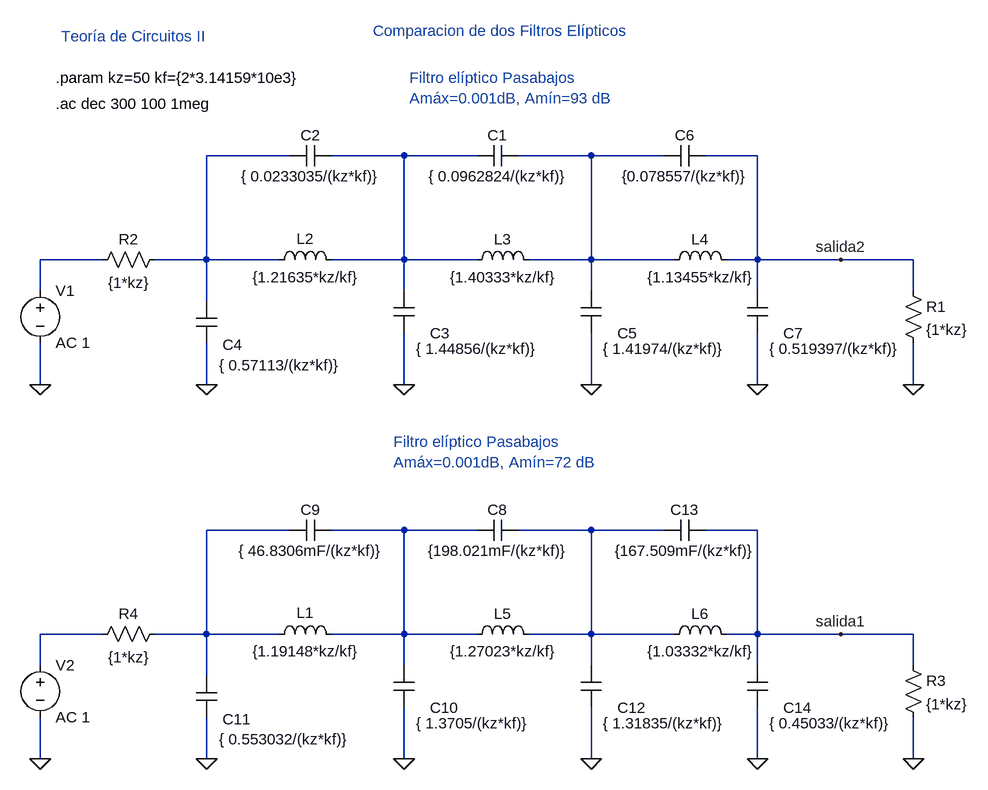
[diagram p0: schematic Filtro elíptico.asc]
Filtro elíptico.asc, the LTspice schematic file:
Version 4
SHEET 1 1436 680
WIRE -320 -1264 -448 -1264
WIRE -144 -1264 -256 -1264
WIRE -32 -1264 -144 -1264
WIRE 144 -1264 32 -1264
WIRE 256 -1264 144 -1264
WIRE 400 -1264 320 -1264
WIRE -608 -1104 -704 -1104
WIRE -448 -1104 -448 -1264
WIRE -448 -1104 -528 -1104
WIRE -336 -1104 -448 -1104
WIRE -144 -1104 -144 -1264
WIRE -144 -1104 -256 -1104
WIRE -32 -1104 -144 -1104
WIRE 144 -1104 144 -1264
WIRE 144 -1104 48 -1104
WIRE 272 -1104 144 -1104
WIRE 400 -1104 400 -1264
WIRE 400 -1104 352 -1104
WIRE 528 -1104 400 -1104
WIRE 640 -1104 528 -1104
WIRE -704 -1056 -704 -1104
WIRE -144 -1056 -144 -1104
WIRE 144 -1056 144 -1104
WIRE 400 -1056 400 -1104
WIRE 640 -1056 640 -1104
WIRE -448 -1040 -448 -1104
WIRE -704 -912 -704 -976
WIRE -448 -912 -448 -976
WIRE -144 -912 -144 -992
WIRE 144 -912 144 -992
WIRE 400 -912 400 -992
WIRE 640 -912 640 -976
WIRE -320 -688 -448 -688
WIRE -144 -688 -256 -688
WIRE -32 -688 -144 -688
WIRE 144 -688 32 -688
WIRE 256 -688 144 -688
WIRE 400 -688 320 -688
WIRE -608 -528 -704 -528
WIRE -448 -528 -448 -688
WIRE -448 -528 -528 -528
WIRE -336 -528 -448 -528
WIRE -144 -528 -144 -688
WIRE -144 -528 -256 -528
WIRE -32 -528 -144 -528
WIRE 144 -528 144 -688
WIRE 144 -528 48 -528
WIRE 272 -528 144 -528
WIRE 400 -528 400 -688
WIRE 400 -528 352 -528
WIRE 528 -528 400 -528
WIRE 640 -528 528 -528
WIRE -704 -480 -704 -528
WIRE -144 -480 -144 -528
WIRE 144 -480 144 -528
WIRE 400 -480 400 -528
WIRE 640 -480 640 -528
WIRE -448 -464 -448 -528
WIRE -704 -336 -704 -400
WIRE -448 -336 -448 -400
WIRE -144 -336 -144 -416
WIRE 144 -336 144 -416
WIRE 400 -336 400 -416
WIRE 640 -336 640 -400
FLAG 640 -912 0
FLAG 528 -1104 salida2
FLAG 144 -912 0
FLAG -448 -912 0
FLAG -144 -912 0
FLAG 400 -912 0
FLAG -704 -912 0
FLAG 640 -336 0
FLAG 528 -528 salida1
FLAG 144 -336 0
FLAG -448 -336 0
FLAG -144 -336 0
FLAG 400 -336 0
FLAG -704 -336 0
SYMBOL res 624 -1072 R0
SYMATTR InstName R1
SYMATTR Value {1*kz}
SYMBOL res -512 -1120 R90
WINDOW 0 0 56 VBottom 0
WINDOW 3 36 56 VTop 0
SYMATTR InstName R2
SYMATTR Value {1*kz}
SYMBOL cap -32 -1248 R270
WINDOW 3 0 32 VBottom 0
WINDOW 0 32 32 VTop 0
SYMATTR Value { 0.0962824/(kz*kf)}
SYMATTR InstName C1
SYMBOL ind -352 -1088 R270
WINDOW 0 33 56 VTop 0
WINDOW 3 5 56 VBottom 0
SYMATTR InstName L2
SYMATTR Value {1.21635*kz/kf}
SYMBOL cap -320 -1248 R270
WINDOW 3 0 32 VBottom 0
WINDOW 0 32 32 VTop 0
SYMATTR Value { 0.0233035/(kz*kf)}
SYMATTR InstName C2
SYMBOL ind -48 -1088 R270
WINDOW 0 32 56 VTop 0
WINDOW 3 5 56 VBottom 0
SYMATTR InstName L3
SYMATTR Value {1.40333*kz/kf}
SYMBOL cap -160 -1056 R0
WINDOW 3 34 89 Left 0
WINDOW 0 56 65 Left 0
SYMATTR Value { 1.44856/(kz*kf)}
SYMATTR InstName C3
SYMBOL ind 256 -1088 R270
WINDOW 0 32 56 VTop 0
WINDOW 3 5 56 VBottom 0
SYMATTR InstName L4
SYMATTR Value {1.13455*kz/kf}
SYMBOL cap -464 -1040 R0
WINDOW 3 35 98 Left 0
WINDOW 0 41 67 Left 0
SYMATTR Value { 0.57113/(kz*kf)}
SYMATTR InstName C4
SYMBOL cap 128 -1056 R0
WINDOW 3 34 89 Left 0
WINDOW 0 56 65 Left 0
SYMATTR Value { 1.41974/(kz*kf)}
SYMATTR InstName C5
SYMBOL cap 256 -1248 R270
WINDOW 3 0 32 VBottom 0
WINDOW 0 32 32 VTop 0
SYMATTR Value {0.078557/(kz*kf)}
SYMATTR InstName C6
SYMBOL cap 384 -1056 R0
WINDOW 3 34 89 Left 0
WINDOW 0 56 65 Left 0
SYMATTR Value { 0.519397/(kz*kf)}
SYMATTR InstName C7
SYMBOL voltage -704 -1072 R0
SYMATTR InstName V1
SYMATTR Value AC 1
SYMBOL res 624 -496 R0
SYMATTR InstName R3
SYMATTR Value {1*kz}
SYMBOL res -512 -544 R90
WINDOW 0 0 56 VBottom 0
WINDOW 3 36 56 VTop 0
SYMATTR InstName R4
SYMATTR Value {1*kz}
SYMBOL cap -32 -672 R270
WINDOW 3 0 32 VBottom 0
WINDOW 0 32 32 VTop 0
SYMATTR Value {198.021mF/(kz*kf)}
SYMATTR InstName C8
SYMBOL ind -352 -512 R270
WINDOW 0 33 56 VTop 0
WINDOW 3 5 56 VBottom 0
SYMATTR InstName L1
SYMATTR Value {1.19148*kz/kf}
SYMBOL cap -320 -672 R270
WINDOW 3 0 32 VBottom 0
WINDOW 0 32 32 VTop 0
SYMATTR Value { 46.8306mF/(kz*kf)}
SYMATTR InstName C9
SYMBOL ind -48 -512 R270
WINDOW 0 32 56 VTop 0
WINDOW 3 5 56 VBottom 0
SYMATTR InstName L5
SYMATTR Value {1.27023*kz/kf}
SYMBOL cap -160 -480 R0
WINDOW 3 34 89 Left 0
WINDOW 0 56 65 Left 0
SYMATTR Value { 1.3705/(kz*kf)}
SYMATTR InstName C10
SYMBOL ind 256 -512 R270
WINDOW 0 32 56 VTop 0
WINDOW 3 5 56 VBottom 0
SYMATTR InstName L6
SYMATTR Value {1.03332*kz/kf}
SYMBOL cap -464 -464 R0
WINDOW 3 35 98 Left 0
WINDOW 0 41 67 Left 0
SYMATTR Value { 0.553032/(kz*kf)}
SYMATTR InstName C11
SYMBOL cap 128 -480 R0
WINDOW 3 34 89 Left 0
WINDOW 0 56 65 Left 0
SYMATTR Value { 1.31835/(kz*kf)}
SYMATTR InstName C12
SYMBOL cap 256 -672 R270
WINDOW 3 0 32 VBottom 0
WINDOW 0 32 32 VTop 0
SYMATTR Value {167.509mF/(kz*kf)}
SYMATTR InstName C13
SYMBOL cap 384 -480 R0
WINDOW 3 34 89 Left 0
WINDOW 0 56 65 Left 0
SYMATTR Value { 0.45033/(kz*kf)}
SYMATTR InstName C14
SYMBOL voltage -704 -496 R0
SYMATTR InstName V2
SYMATTR Value AC 1
TEXT -136 -1384 Left 0 ;Filtro elíptico Pasabajos\nAmáx=0.001dB, Amín=93 dB
TEXT -680 -1344 Left 0 !.ac dec 300 100 1meg
TEXT -160 -824 Left 0 ;Filtro elíptico Pasabajos\nAmáx=0.001dB, Amín=72 dB
TEXT -680 -1384 Left 0 !.param kz=50 kf={2*3.14159*10e3}
TEXT -192 -1456 Left 0 ;Comparacion de dos Filtros Elípticos
TEXT -672 -1448 Left 0 ;Teoría de Circuitos II

The netlist it stands for:
* Filtro elíptico.asc
R1 salida2 0 {1*kz}
R2 N001 N004 {1*kz}
C1 N002 N003 { 0.0962824/(kz*kf)}
L2 N001 N002 {1.21635*kz/kf}
C2 N001 N002 { 0.0233035/(kz*kf)}
L3 N002 N003 {1.40333*kz/kf}
C3 N002 0 { 1.44856/(kz*kf)}
L4 N003 salida2 {1.13455*kz/kf}
C4 N001 0 { 0.57113/(kz*kf)}
C5 N003 0 { 1.41974/(kz*kf)}
C6 N003 salida2 {0.078557/(kz*kf)}
C7 salida2 0 { 0.519397/(kz*kf)}
V1 N004 0 AC 1
R3 salida1 0 {1*kz}
R4 N005 N008 {1*kz}
C8 N006 N007 {198.021mF/(kz*kf)}
L1 N005 N006 {1.19148*kz/kf}
C9 N005 N006 { 46.8306mF/(kz*kf)}
L5 N006 N007 {1.27023*kz/kf}
C10 N006 0 { 1.3705/(kz*kf)}
L6 N007 salida1 {1.03332*kz/kf}
C11 N005 0 { 0.553032/(kz*kf)}
C12 N007 0 { 1.31835/(kz*kf)}
C13 N007 salida1 {167.509mF/(kz*kf)}
C14 salida1 0 { 0.45033/(kz*kf)}
V2 N008 0 AC 1
* Filtro elíptico Pasabajos
* Amáx=0.001dB, Amín=93 dB
.ac dec 300 100 1meg
* Filtro elíptico Pasabajos
* Amáx=0.001dB, Amín=72 dB
.param kz=50 kf={2*3.14159*10e3}
* Comparacion de dos Filtros Elípticos
* Teoría de Circuitos II
.backanno
.end